# EAGLE design Aegaeon REV C PROTO (EAGLE 6.1)
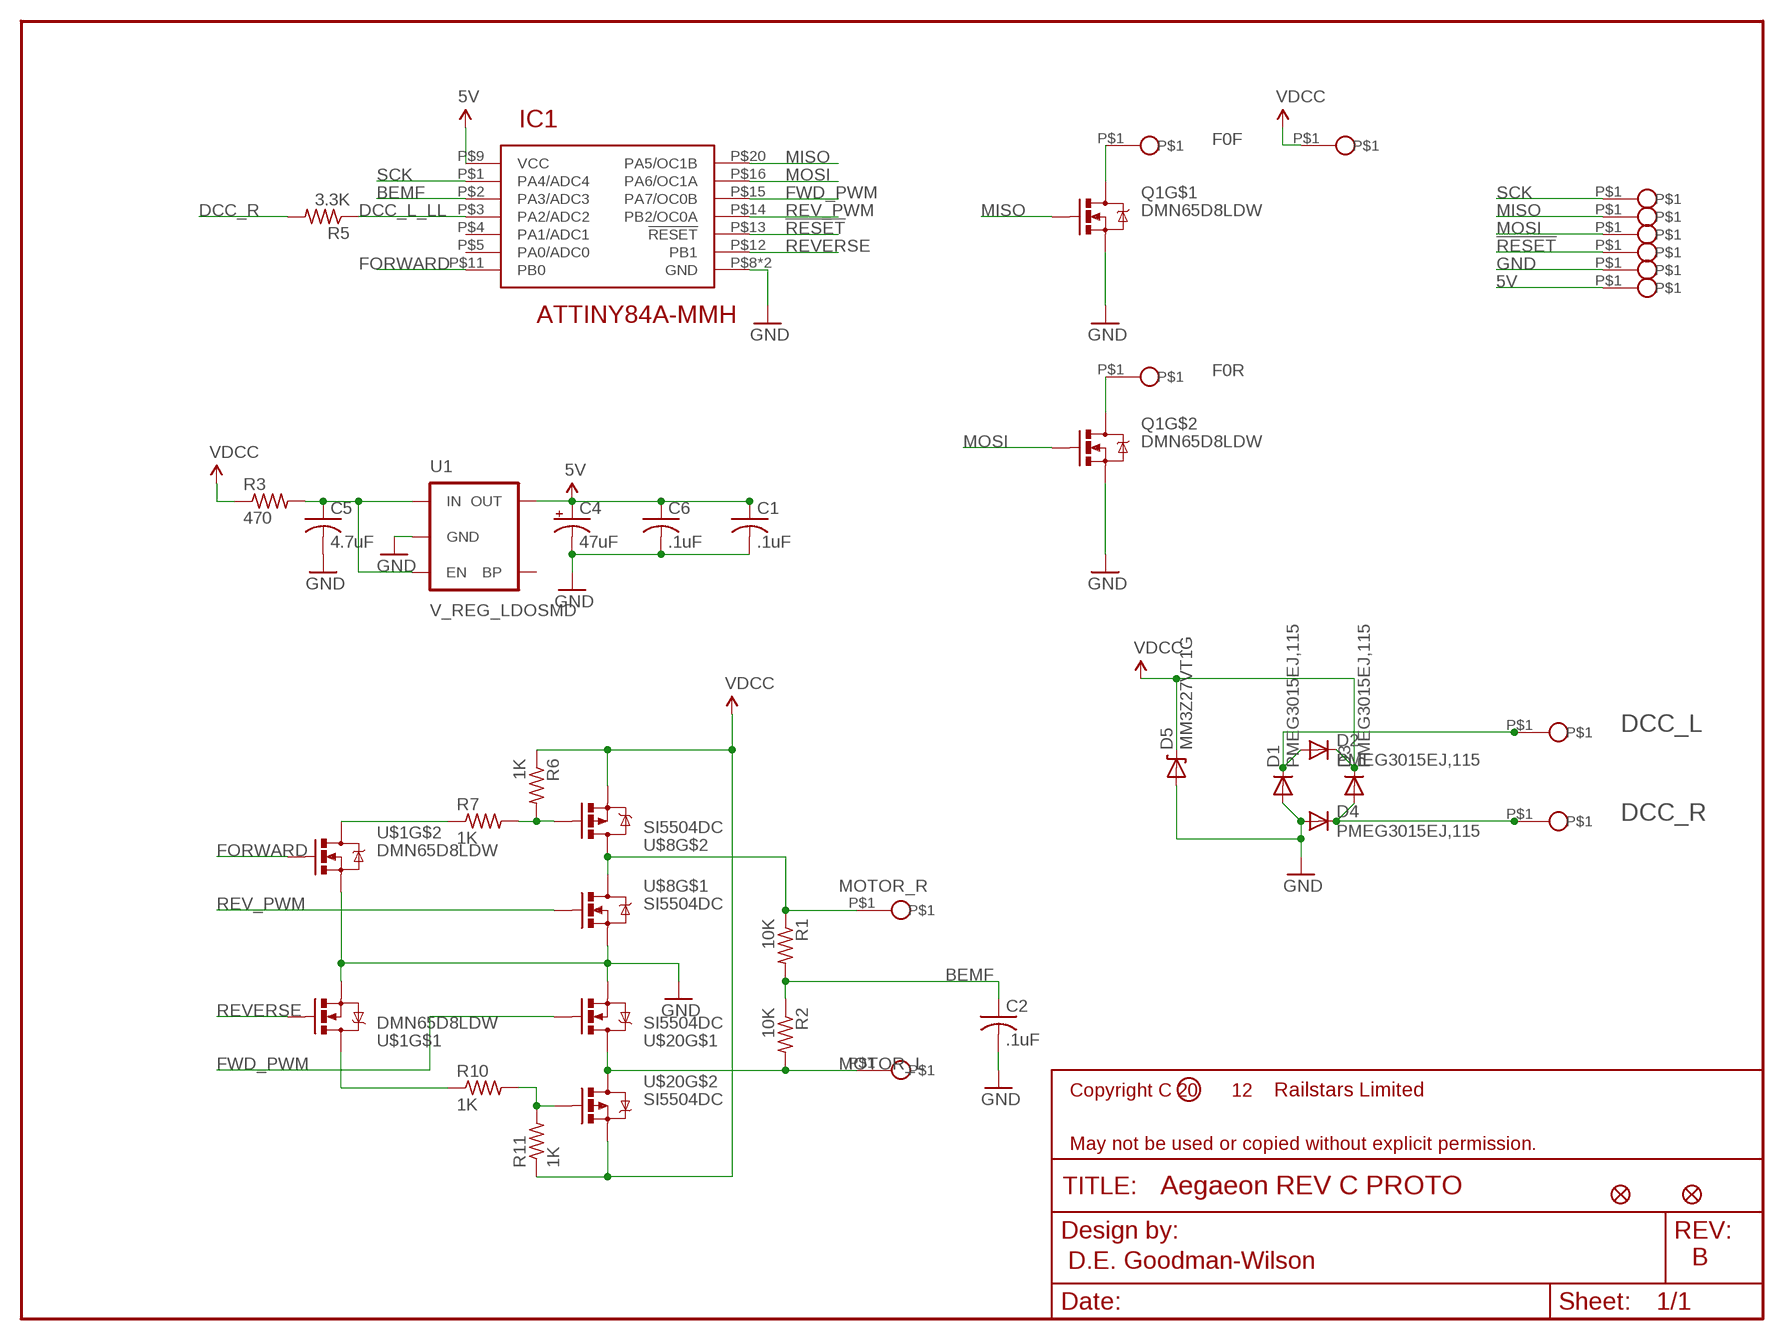
[diagram p0: schematic, sheet 1]

## Parts
C1  .1uF  C-USC0201  [C0201]
C2  .1uF  C-USC0402  [C0402]
C4  47uF  CPOL-USF980J476MMA  [CPOL0603]
C5  4.7uF  C-USC0603  [C0603]
C6  .1uF  C-USC0402  [C0402]
D1  PMEG3015EJ,115  DIODESOD  [SOD-323]
D2  PMEG3015EJ,115  DIODESOD  [SOD-323]
D3  PMEG3015EJ,115  DIODESOD  [SOD-323]
D4  PMEG3015EJ,115  DIODESOD  [SOD-323]
D5  MM3Z27VT1G  DIODE-ZENER-BZT52  [SOD-323]
DCC_L  PAD1MM  [LED_SOLDER_PAD]
DCC_R  PAD1MM  [LED_SOLDER_PAD]
IC1  ATTINY84A-MMH  [VQFN-20]
JP2  FIDUCIALUFIDUCIAL  [MICRO-FIDUCIAL]
JP4  FIDUCIALUFIDUCIAL  [MICRO-FIDUCIAL]
Q1  DMN65D8LDW  [SOT363]
R1  10K  R-US_R0201  [R0201]
R2  10K  R-US_R0201  [R0201]
R3  470  R-US_R0201  [R0201]
R5  3.3K  R-US_R0201  [R0201]
R6  1K  R-US_R0201  [R0201]
R7  1K  R-US_R0201  [R0201]
R10  1K  R-US_R0201  [R0201]
R11  1K  R-US_R0201  [R0201]
U1  V_REG_LDOSMD  [SOT23-5]
U$1  DMN65D8LDW  [SOT363]
U$2  PAD1MM  [LED_SOLDER_PAD]
U$3  PAD1MM  [LED_SOLDER_PAD]
U$5  PAD1MM  [LED_SOLDER_PAD]
U$8  SI5504DC  [1206-8]
U$10  PAD1MM  [LED_SOLDER_PAD]
U$11  PAD1MM  [LED_SOLDER_PAD]
U$14  PAD.75MM  [POGO_PAD]
U$15  PAD.75MM  [POGO_PAD]
U$16  PAD.75MM  [POGO_PAD]
U$17  PAD.75MM  [POGO_PAD]
U$18  PAD.75MM  [POGO_PAD]
U$19  PAD.75MM  [POGO_PAD]
U$20  SI5504DC  [1206-8]

## Nets
5V: C1.1 C4.1(+) C6.1 IC1.P$9(VCC) U1.5(OUT) U$19.P$1
!RESET: IC1.P$13(!RESET) U$17.P$1
BEMF: C2.1 IC1.P$2(PA3/ADC3) R1.2 R2.1
DCC_L: D1.1(C) D2.2(A) DCC_L.P$1
DCC_L_LL: IC1.P$3(PA2/ADC2) R5.1
DCC_R: D3.2(A) D4.1(C) DCC_R.P$1 R5.2
F0F: Q1.P$4(D) U$10.P$1
F0R: Q1.P$1(D) U$5.P$1
FORWARD: IC1.P$11(PB0) U$1.P$5(G)
FWD_PWM: IC1.P$15(PA7/OC0B) U$20.P$2(G)
GND: C1.2 C2.2 C4.2(-) C5.2 C6.2 D1.2(A) D4.2(A) D5.2(A) IC1.P$8(GND) IC1.P$21(GND) Q1.P$3(S) Q1.P$6(S) U1.2(GND) U$1.P$3(S) U$1.P$6(S) U$8.P$1(S) U$18.P$1 U$20.P$1(S)
MISO: IC1.P$20(PA5/OC1B) Q1.P$2(G) U$15.P$1
MOSI: IC1.P$16(PA6/OC1A) Q1.P$5(G) U$16.P$1
MOTOR_L: R2.2 U$3.P$1 U$20.P$5(D) U$20.P$6(D) U$20.P$7(D) U$20.P$8(D)
MOTOR_R: R1.1 U$2.P$1 U$8.P$5(D) U$8.P$6(D) U$8.P$7(D) U$8.P$8(D)
N$1: R6.2 R7.2 U$8.P$4(G)
N$2: C5.1 R3.2 U1.1(IN) U1.3(EN)
N$4: R10.2 R11.2 U$20.P$4(G)
N$10: R10.1 U$1.P$4(D)
N$11: R7.1 U$1.P$1(D)
REV_PWM: IC1.P$14(PB2/OC0A) U$8.P$2(G)
REVERSE: IC1.P$12(PB1) U$1.P$2(G)
SCK: IC1.P$1(PA4/ADC4) U$14.P$1
VDCC: D2.1(C) D3.1(C) D5.1(C) R3.1 R6.1 R11.1 U$8.P$3(S) U$11.P$1 U$20.P$3(S)
Unconnected: IC1.P$4(PA1/ADC1) IC1.P$5(PA0/ADC0) U1.4(BP)

## Notes on the sheet
- 12 | Railstars Limited
- D.E. Goodman-Wilson | B

## Library data of the parts
C1 C2 C5 C6 = rcl:C-US: CAPACITOR, American symbol
C4 = rcl:CPOL-US: POLARIZED CAPACITOR, American symbol
D1-D4 = Railstars:DIODE: Diode These are standard reverse protection diodes and small signal diodes. SMA package can handle up to about 1A. SOD-323 can handle about 200mA. What the SOD-323 package when ordering, there are some mfgs out there that are 5-pin packages.
D5 = SparkFun-DiscreteSemi:DIODE-ZENER: Zener Diode Production Part - 8199 3.4V Zener Voltage
DCC_L DCC_R U$2 U$3 U$5 U$10 U$11 U$14-U$19 = Railstars:PAD
IC1 = Railstars:ATTINY84A
JP2 JP4 = SparkFun-Aesthetics:FIDUCIAL: Fiducial Alignment Points Various fiducial points for machine vision alignment.
Q1 U$1 = Railstars:DMN65D8LDW
R1-R3 R5-R7 R10 R11 = rcl:R-US_: RESISTOR, American symbol
U1 = SparkFun-PowerIC:V_REG_LDO: Voltage Regulator LDO Standard 150mA LDO voltage regulator in SOT-23 layout. Micrel part MIC5205. BP (by-pass) pin is used to lower output noise with 470pF cap.
U$8 U$20 = Railstars:SI5504DC

## Board
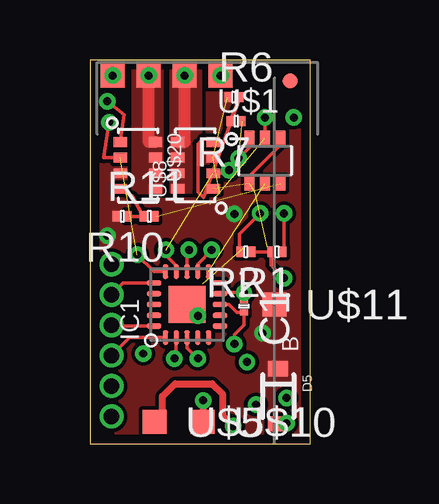
[diagram p1: board, top side]
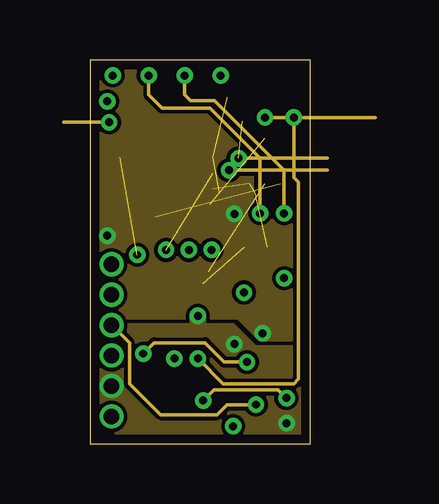
[diagram p2: board, inner layer Route8]
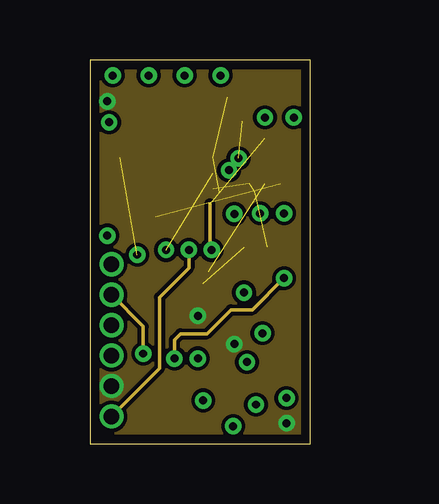
[diagram p3: board, inner layer Route9]
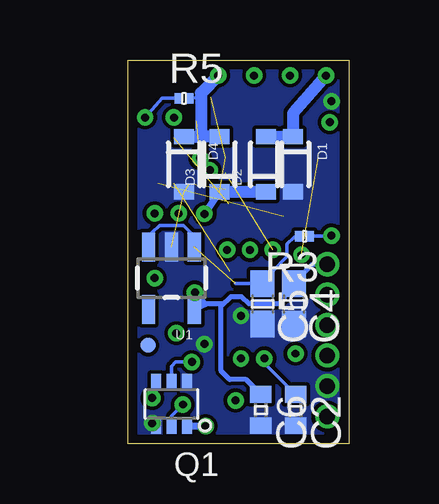
[diagram p4: board, bottom side, seen from below]

Size 9.2 x 16 mm. Coordinates in mm from the lower left corner, seen from the top.
Outline: 0,0 9.2,0 9.2,16 0,16 0,0
Copper layers (1*8+9*16): Top 0.0356mm / dielectric 1.5011mm / Route8 0.0356mm / dielectric 0.1499mm / Route9 0.0356mm / dielectric 0.2007mm / Bottom 0.0356mm
Design rules: minimum track width 6mil, minimum drill 13mil, track to track 6mil, track to pad 6mil, pad to pad 6mil, via to via 6mil, smd to smd 0mil, copper to edge 15mil, drill to drill 6mil, minimum pad ring 7mil, minimum via ring 7mil, stop-mask expansion 4mil, vias tented up to drill 20mil, thermal gap 10mil

### Footprints (pad centres in the part's own frame; a part is rotated, then mirrored left to right if it is on the bottom)
C0201 = smd 0.25 x 0.35: 1 -0.25,0; 2 0.25,0
C0402 = smd 0.7 x 0.9: 1 -0.65,0; 2 0.65,0
CPOL0603 = smd 1.1 x 1: 1 -0.85,0; 2 0.85,0
C0603 = smd 1.1 x 1: 1 -0.85,0; 2 0.85,0
SOD-323 = smd 0.63 x 0.83: 1 -1.15,0; 2 1.15,0
LED_SOLDER_PAD = smd 1 x 1: P$1 0,0
VQFN-20 = smd 0.6 x 0.22: P$1 -1.375,0.9; P$2 -1.375,0.45; P$3 -1.375,0; P$4 -1.375,-0.45; P$5 -1.375,-0.9; P$11 1.375,-0.9; P$12 1.375,-0.45; P$13 1.375,0; P$14 1.375,0.45; P$15 1.375,0.9 | smd 0.22 x 0.6: P$6 -0.9,-1.375; P$7 -0.45,-1.375; P$8 0,-1.375; P$9 0.45,-1.375; P$10 0.9,-1.375; P$16 0.9,1.375; P$17 0.45,1.375; P$18 0,1.375; P$19 -0.45,1.375; P$20 -0.9,1.375 | smd 1.55 x 1.55: P$21 0,0
MICRO-FIDUCIAL = smd 0.635 x 0.635: 1 0,0
SOT363 = smd 0.42 x 0.6: P$1 -0.65,0.95; P$2 0,0.95; P$3 0.65,0.95; P$4 0.65,-0.95; P$5 0,-0.95; P$6 -0.65,-0.95
R0201 = smd 0.28 x 0.43: 1 -0.255,0; 2 0.255,0
SOT23-5 = smd 0.55 x 1.2: 1 -0.95,-1.3; 2 0,-1.3; 3 0.95,-1.3; 4 0.95,1.3; 5 -0.95,1.3
1206-8 = smd 0.406 x 0.559: P$1 -0.975,-0.737; P$2 -0.325,-0.737; P$3 0.325,-0.737; P$4 0.975,-0.737; P$5 0.975,0.737; P$6 0.325,0.737; P$7 -0.325,0.737; P$8 -0.975,0.737
POGO_PAD = smd 0.75 x 0.75: P$1 0,0

### Placement (x,y rotation side)
C1  6.42,5.72 270 top
C2  2.23,1.4 270 bottom
C4  2.3,5.83 270 bottom
C5  3.6,5.83 270 bottom
C6  3.67,1.4 270 bottom
D1  2.33,11.65 270 bottom
D2  3.45,11.65 90 bottom
D3  5.4,11.65 90 bottom
D4  6.88,11.65 270 bottom
D5  7.85,1.98 270 top
DCC_L  0.95,15.35 0 top
DCC_R  5.45,15.35 0 top
IC1  4.05,5.8 90 top
JP2  8.35,15.12 0 top
JP4  8.38,4.1 0 bottom
Q1  7.4,1.65 180 bottom
R1  7.8,8 180 top
R2  6.5,8 180 top
R3  1.85,8.65 180 bottom
R5  6.88,14.4 0 bottom
R6  6,14.45 0 top
R7  6.1,13.45 180 top
R10  2.48,9.47 180 top
R11  1.35,9.47 0 top
U1  7.4,6.9 180 bottom
U$1  7.3,11.8 0 top
U$2  3.95,15.35 0 top
U$3  2.45,15.35 0 top
U$5  2.7,0.9 0 top
U$8  4.4,11.6 90 top
U$10  4.7,0.9 0 top
U$11  7.7,5.8 0 top
U$14  0.9,3.67 0 top
U$15  0.9,4.94 0 top
U$16  0.9,6.21 0 top
U$17  0.9,1.13 0 top
U$18  0.9,2.4 0 top
U$19  0.9,7.48 0 top
U$20  2,11.6 270 top

### Tracks (layer width: path | path; a pad name or v marks a point on that pad's centre or on a via)
5V  (via drill 0.33, 0.65)
  Top 0.152: C1.1 v6.42,6.3 5.47,6.3 IC1.P$9
  Bottom 0.2: U$19.P$1 1.5,7.48 C4.1 2.7,6.28 2.7,6.05 2.92,5.83 4.17,5.83 4.47,6.12 4.92,6.12 5.33,5.72 | C6.1 4.3,2.67 4.97,2.67 5.33,3.02 5.33,5.72 | 5.33,5.72 5.33,5.83 6.22,5.83 U1.5 5.95,5.83 v6.42,6.3
  other vias: 0.9,7.48
!RESET  (via drill 0.33, 0.65)
  Top 0.152: IC1.P$13 4.05,8 v4.12,8.07
  Route9 0.152: U$17.P$1 2.9,3.13 2.9,6.1 4.12,7.33 v4.12,8.07
  other vias: 0.9,1.13
BEMF  (via drill 0.33)
  Top 0.152: IC1.P$2 3.6,3.62 v3.52,3.55 | R2.1 R1.2 7.54,7.46 v8.1,6.9
  Route9 0.152: v3.52,3.55 3.52,4.33 3.77,4.58 4.88,4.58 5.88,5.58 6.78,5.58 v8.1,6.9
  Bottom 0.152: C2.1 3.52,3.35 v3.52,3.55
DCC_L  (via drill 0.33)
  Bottom 0.5: DCC_L.P$1 2.33,13.78 D1.1 D2.2
  other vias: 0.95,15.35
DCC_L_LL  (via drill 0.33)
  Top 0.152: IC1.P$3 4.05,4 v4.5,3.55
  Route8 0.152: v4.5,3.55 5.55,2.5 8.5,2.5 8.7,2.7 8.7,10.9 8.5,11.1 v8.5,13.6
  Bottom 0.152: R5.1 7.8,14.4 v8.5,13.6
DCC_R  (via drill 0.33)
  Bottom 0.152: R5.2 6.17,14.46
  Bottom 0.5: D3.2 6.17,12.8 | D4.1 6.17,12.8 | DCC_R.P$1 6.17,14.62 6.17,14.46 6.17,12.8
  other vias: 5.45,15.35
F0F  (via drill 0.33)
  Top 0.3: v4.72,1.8 4.72,0.93 U$10.P$1
  Route8 0.152: v4.72,1.8 5.17,2.25 7.85,2.25 v8.2,1.9
  Bottom 0.152: Q1.P$4 8.05,2.05 v8.2,1.9
F0R  (via drill 0.33)
  Top 0.3: U$5.P$1 3.02,1.23 3.02,1.98 3.55,2.5 5.1,2.5 5.53,2.08 5.53,1.18 v5.97,0.72
  Bottom 0.3: v5.97,0.72 6.72,0.72 Q1.P$1
FORWARD  (1 unrouted)
FWD_PWM  (via drill 0.33)  (1 unrouted)
  Top 0.152: IC1.P$15 2.67,7.17 v1.98,7.88 | U$20.P$2 0.57,11.93 v0.8,13.4
  Route8 0.152: v0.8,13.4 -1.1,13.4
GND  (via drill 0.33, 0.65)  (3 unrouted)
  Top 0.152: IC1.P$8 5.8,5.8 6.12,5.47 C1.2 6.42,4.95 6.03,4.55 v6.03,4.15 | v8.2,0.85 7.88,0.85 D5.2 | U$20.P$1 1.43,13.71 v0.72,14.28 | U$1.P$3 7.95,12.45 6.65,11.15 U$1.P$6
  Top 0.2: v4.5,5.33 4.5,5.35 IC1.P$21
  other vias: 0.9,2.4
  pour Bottom (no thermals): 0,0 0,16 9.2,16 9.2,0
  pour Route9: 9.2,16 0,16 0,0 9.2,0
  pour Route8 (rank 2): 0,0 9.2,0 9.2,5.28 0,5.28
MISO  (via drill 0.33, 0.65)
  Top 0.152: IC1.P$20 0.94,4.9 U$15.P$1
  Route8 0.152: U$15.P$1 1.65,4.19 1.65,2.5 2.95,1.2 5.3,1.2 5.72,1.62 v6.92,1.62
  Bottom 0.152: Q1.P$2 7.4,1.15 v6.92,1.62
  other vias: 0.9,4.94
MOSI  (via drill 0.33, 0.65)
  Top 0.152: IC1.P$16 1.39,6.7 U$16.P$1
  Route8 0.152: v2.23,3.75 2.67,4.2 4.8,4.2 5.6,3.4 v6.55,3.4
  Route9 0.152: v2.23,3.75 2.23,4.88 U$16.P$1
  Bottom 0.152: Q1.P$5 7.4,3.23 7.22,3.4 v6.55,3.4
  other vias: 0.9,6.21
MOTOR_L  (via drill 0.33)
  Top 0.152: R2.2 6.25,8.74 v7.1,9.6
  Top 0.5: U$20.P$8 2.45,12.57 U$3.P$1
  Route8 0.152: v7.1,9.6 7.1,11.9 5,14 3,14 2.45,14.55 U$3.P$1
  other vias: 2.45,15.35
  pour Top (no thermals): 1.8,10.5 3,10.5 3,16 1.8,16
MOTOR_R  (via drill 0.33)
  Top 0.152: v8.1,9.6 8.1,8.04 R1.1
  Top 0.5: U$8.P$5 3.95,12.57 U$2.P$1
  Route8 0.152: v8.1,9.6 8.1,11.4 5.2,14.3 4.2,14.3 3.95,14.55 U$2.P$1
  other vias: 3.95,15.35
  pour Top (no thermals): 3.4,10.5 3.4,16 4.6,16 4.6,10.5
N$1
  Top 0.152: U$8.P$4 5.06,12.7 4.7,12.7 4.5,12.5 4.5,10.5 4.75,10.26 R6.2 R7.2
N$2  (1 unrouted)
  Bottom 0.152: 4.72,6.67 C5.1 3.6,6.7 3.17,7.12 3.17,7.2 2.58,7.8 2.58,8.32 2.27,8.62 2.13,8.62 R3.2 | U1.1 6.6,8.35 6.6,8.8 6.9,9.1 7.9,9.1 8.2,8.8 8.2,8.7 8.35,8.55 U1.3
N$4
  Top 0.152: U$20.P$4 1.78,10.31 R10.2 R11.2
N$10  (1 unrouted)
N$11  (via drill 0.33)  (1 unrouted)
  Top 0.152: U$1.P$1 6.65,12.35 v6.2,11.9
  Route8 0.152: v6.2,11.9 9.9,11.9
REV_PWM  (via drill 0.33)  (1 unrouted)
  Top 0.152: IC1.P$14 3.6,7.42 3.17,7.85 v3.17,8.07 | U$8.P$2 5.67,11.28 v5.8,11.4
  Route8 0.152: v5.8,11.4 9.9,11.4
REVERSE  (via drill 0.33)  (1 unrouted)
  Top 0.152: IC1.P$12 4.5,7.5 v5.08,8.07 | U$1.P$2 v7.3,13.6
  Route8 0.152: v7.3,13.6 11.9,13.6
  Route9 0.152: v5.08,8.07 5,8.15 5,10
SCK  (via drill 0.65)
  Top 0.152: IC1.P$1 1.66,4.42 U$14.P$1
  other vias: 0.9,3.67
VDCC  (via drill 0.33)  (2 unrouted)
  Bottom 0.152: v0.72,8.68 0.75,8.65 R3.1
  Bottom 0.3: v6.03,9.57 D3.1
  Bottom 0.5: D2.1 D3.1
  other vias: 7.2,4.6
  pour Top (rank 2, no thermals): 0,16 9.2,16 9.2,0 0,0
  pour Route8 (no thermals): 0,16 9.2,16 9.2,4.33 7.1,4.33 6.17,5.25 0,5.25

### Text on the board
tPlace: B
tDocu: Aegaeon:L2 DCC Decoder | Copyright (C) 2012, Railstars Limited | All Rights Reserved